# Altium schematic sheet BMS (1).SchDoc
size OrCAD C; SheetNumber: 1; SheetTotal: 1
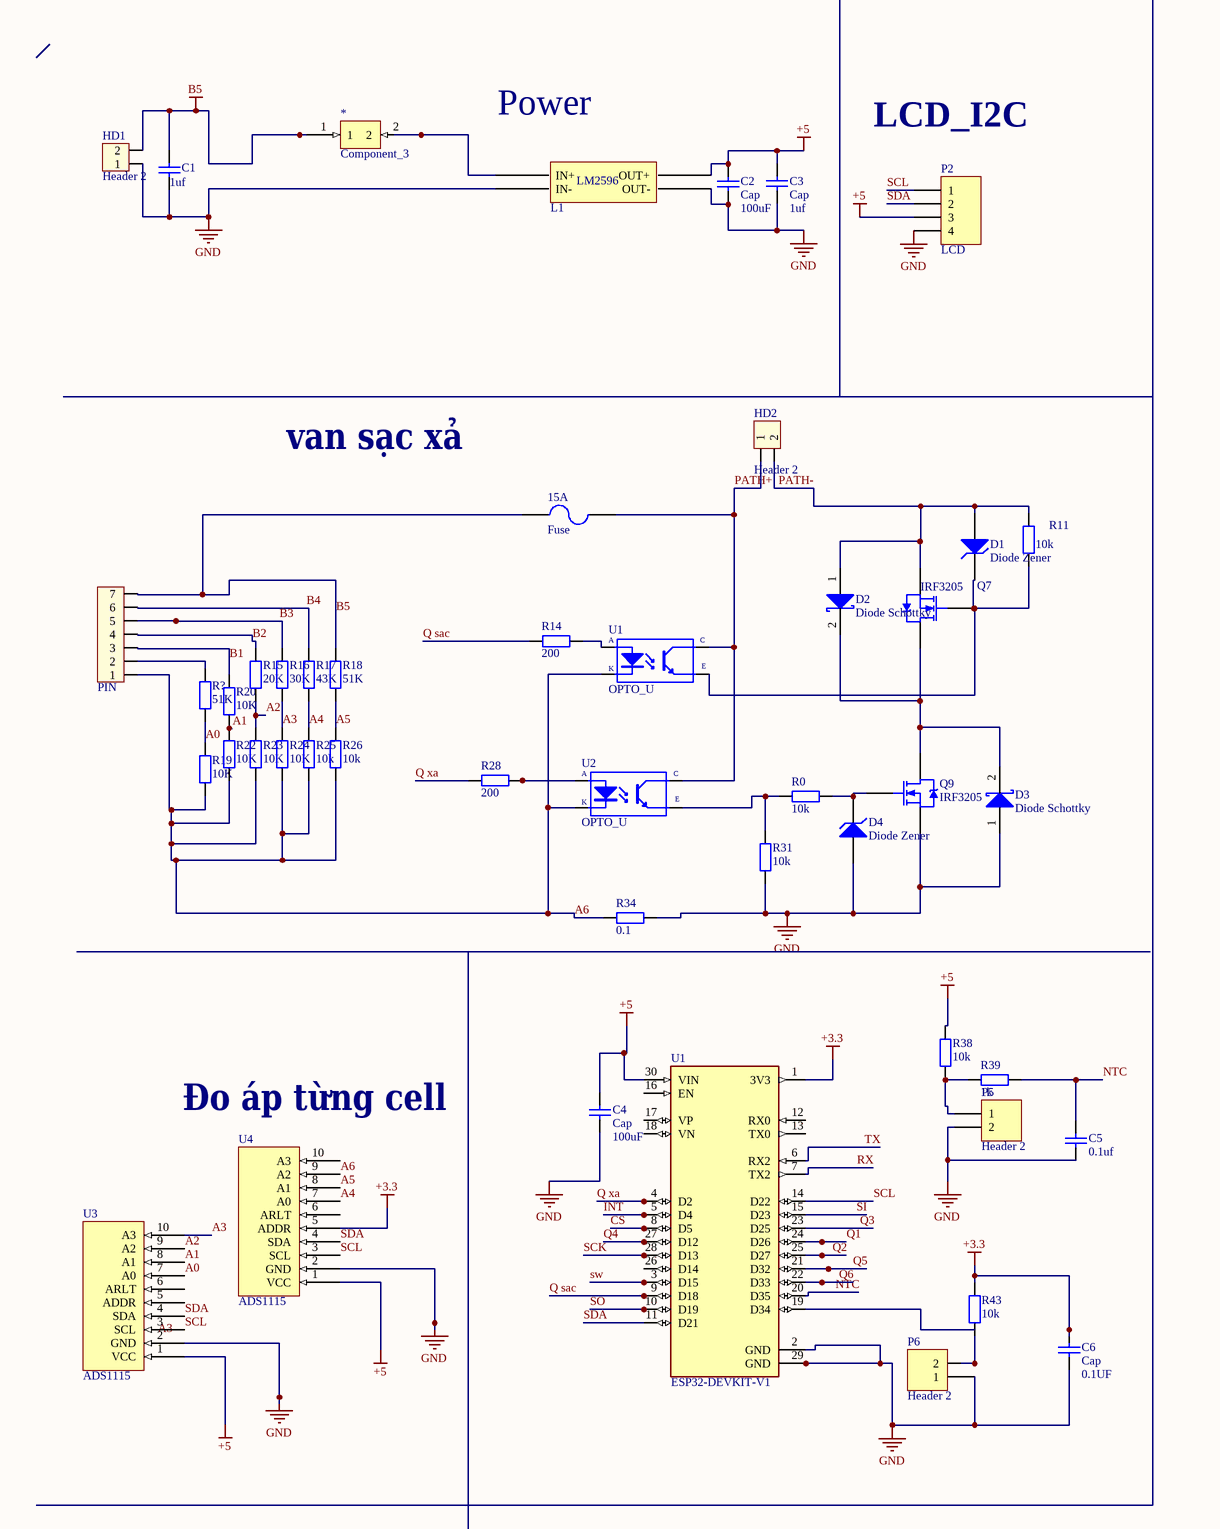
[diagram p0: BMS (1).SchDoc, left]
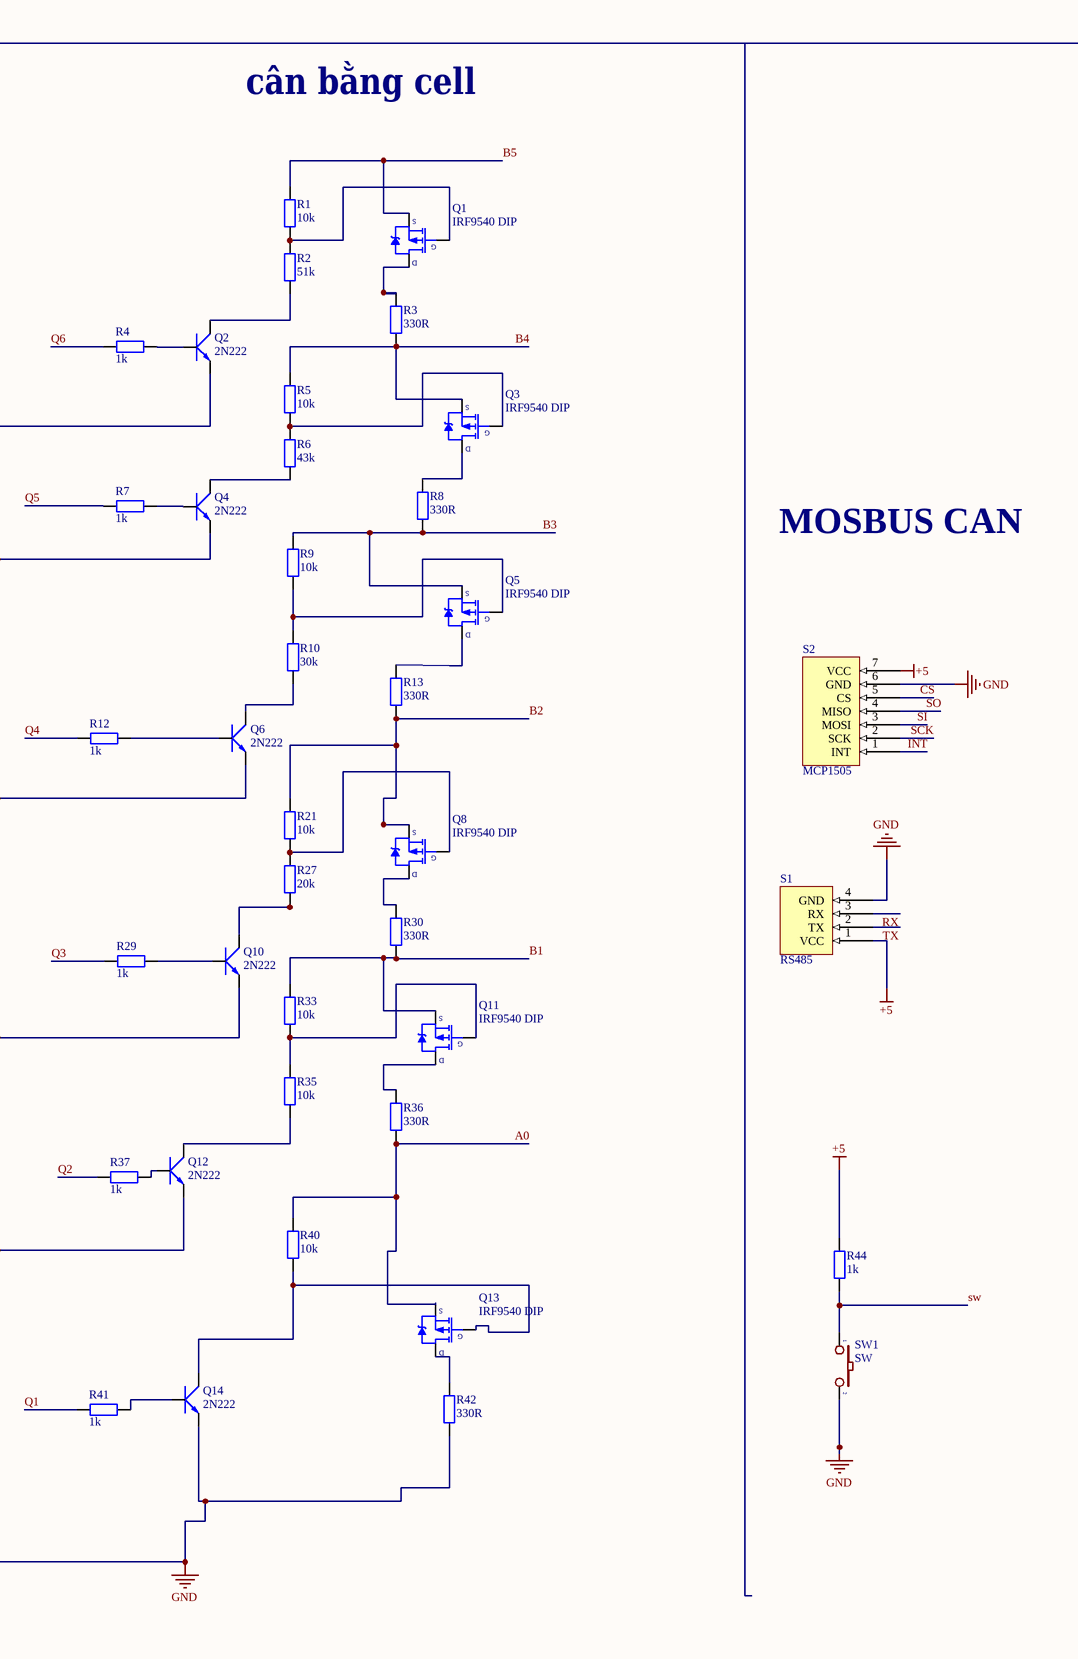
[diagram p1: BMS (1).SchDoc, right]

## Parts
(Parts that share a designator on the sheet are numbered #1, #2 ... from top to bottom, then left to right.)
15A  Fuse  [Fuse]
*  Component_3  [PCBComponent_1]
C1  value 1uf  [C3MM]  (hidden comment: Cap)
C2  Cap  value 100uF  [C3MM]
C3  Cap  value 1uf  [C3MM]
C4  Cap  value 100uF  [C3MM]
C5  0.1uf  [C3MM]
C6  Cap  value 0.1UF  [C3MM]
D1  Diode Zener  [DIODE/NOM/0.5A]
D2  Diode Schottky  [DO-35]
D3  Diode Schottky  [DO-35]
D4  Diode Zener  [DIODE/NOM/0.5A]
H?  PIN  [Header 7P DC 2.54]
HD1  Header 2  [HED2]
HD2  Header 2  [HED2]
L1  (no value)  [BUCK_LM2596]
P2  LCD  [HDR1X4]
P5  Header 2  [Header 2]
P6  Header 2  [Header 2]
Q1  IRF9540 DIP  [TO220]
Q2  2N222  [TO92-123]
Q3  IRF9540 DIP  [TO220]
Q4  2N222  [TO92-123]
Q5  IRF9540 DIP  [TO220]
Q6  2N222  [TO92-123]
Q7  IRF3205  [TO220]
Q8  IRF9540 DIP  [TO220]
Q9  IRF3205  [TO220]
Q10  2N222  [TO92-123]
Q11  IRF9540 DIP  [TO220]
Q12  2N222  [TO92-123]
Q13  IRF9540 DIP  [TO220]
Q14  2N222  [TO92-123]
R0  10k  [tro vach 1/2w]
R1  10k  [tro vach 1/2w]
R2  51k  [tro vach 1/2w]
R3  330R  [tro vach 2w]
R4  1k  [tro vach 1/4w]
R5  10k  [tro vach 1/2w]
R6  43k  [tro vach 1/2w]
R7  1k  [tro vach 1/4w]
R8  330R  [tro vach 2w]
R9  10k  [tro vach 1/2w]
R10  30k  [tro vach 1/2w]
R11  10k  [tro vach 1/2w]
R12  1k  [tro vach 1/4w]
R13  330R  [tro vach 2w]
R14  200  [tro vach 1/2w]
R15  20K  [tro vach 1/2w]
R16  30K  [tro vach 1/2w]
R17  43K  [tro vach 1/2w]
R18  51K  [tro vach 1/2w]
R19  10K  [tro vach 1/2w]
R20  10K  [tro vach 1/2w]
R21  10k  [tro vach 1/2w]
R22  10K  [tro vach 1/2w]
R23  10K  [tro vach 1/2w]
R24  10K  [tro vach 1/2w]
R25  10k  [tro vach 1/2w]
R26  10k  [tro vach 1/2w]
R27  20k  [tro vach 1/2w]
R28  200  [tro vach 1/2w]
R29  1k  [tro vach 1/4w]
R30  330R  [tro vach 2w]
R31  10k  [tro vach 1/2w]
R33  10k  [tro vach 1/2w]
R34  0.1  [tro vach 3w]
R35  10k  [tro vach 1/2w]
R36  330R  [tro vach 2w]
R37  1k  [tro vach 1/4w]
R38  10k  [tro vach 1/2w]
R39  1k  [tro vach 1/2w]
R40  10k  [tro vach 1/2w]
R41  1k  [tro vach 1/4w]
R42  330R  [tro vach 2w]
R43  10k  [tro vach 1/2w]
R44  1k  [tro vach 1/4w]
R?  51K  [tro vach 1/2w]
S1  RS485  [PCBComponent_1]
S2  MCP1505  [PCBComponent_1]
SW1  SW  [SW2]
U1#1  OPTO_U  [OPTO_U]
U1#2  ESP32-DEVKIT-V1  [MODULE_ESP32_DEVKIT_V1]
U2  OPTO_U  [OPTO_U]
U3  ADS1115  [ADS1115]
U4  ADS1115  [ADS1115]

## Nets
+3.3: C6.2 R43.1 U1#2.1(3V3) U4.5(ADDR)
+5: C2.2 C3.2 C4.2 L1.4(OUT+) P2.3 R38.1 R44.1 S1.1(VCC) S2.7(VCC) U1#2.30(VIN) U3.1(VCC) U4.1(VCC)
B5: 15A.1 *.1 C1.2 H?.7 HD1.2 Q1.3(S) R1.2 R18.2
GND: C1.1 C2.1 C3.1 C4.1 C5.1 C6.1 D3.1(A) D4.1(A) HD1.1 L1.2(IN-) L1.3(OUT-) P2.4 P5.2 P6.1 Q2.1(E) Q4.1(E) Q6.1(E) Q9.3(S) Q10.1(E) Q12.1(E) Q14.1(E) R31.2 R34.2 R42.1 S1.4(GND) S2.6(GND) SW1.2 U1#2.2(GND) U1#2.29(GND) U3.2(GND) U4.2(GND)
A0: Q13.3(S) R19.2 R36.1 R40.2 R?.1 U3.7(A0)
A1: R20.1 R22.2 U3.8(A1)
A2: R15.1 R23.2 U3.9(A2)
A3: R16.1 R24.2 U3.10(A3)
A4: R17.1 R25.2 U4.7(A0)
A5: R18.1 R26.2 U4.8(A1)
A6: H?.1 R19.1 R22.1 R23.1 R24.1 R25.1 R26.1 R34.1 U1#1.K U2.K U4.9(A2)
B1: H?.3 Q11.3(S) R20.2 R30.1 R33.2
B2: H?.4 Q8.3(S) R13.1 R15.2 R21.2
B3: H?.5 Q5.3(S) R8.1 R9.2 R16.2
B4: H?.6 Q3.3(S) R3.1 R5.2 R17.2
CS: S2.5(CS) U1#2.8(D5)
INT: S2.1(INT) U1#2.5(D4)
NTC: C5.2 R39.2 U1#2.20(D35)
PATH+: 15A.2 HD2.1 U1#1.C U2.C
PATH-: D1.1(A) D2.1(A) HD2.2 Q7.3(S) R11.2
Q1: R41.2 U1#2.24(D26)
Q2: R37.2 U1#2.25(D27)
Q3: R29.2 U1#2.23(D25)
Q4: R12.2 U1#2.27(D12)
Q5: R7.2 U1#2.21(D32)
Q6: R4.2 U1#2.22(D33)
Q sac: R14.2 U1#2.9(D18)
Q xa: R28.2 U1#2.4(D2)
RX: S1.3(RX) U1#2.7(TX2)
SCK: S2.2(SCK) U1#2.28(D13)
SCL: P2.1 U1#2.14(D22) U3.3(SCL) U4.3(SCL)
SDA: P2.2 U1#2.11(D21) U3.4(SDA) U4.4(SDA)
SI: S2.3(MOSI) U1#2.15(D23)
SO: S2.4(MISO) U1#2.10(D19)
sw: R44.2 SW1.1 U1#2.3(D15)
TX: S1.2(TX) U1#2.6(RX2)
Net*_2: *.2 L1.1(IN+)
NetD1_2: D1.2(K) Q7.1(G) R11.1 U1#1.E
NetD2_2: D2.2 D3.2 Q7.2(D) Q9.2(D)
NetD4_2: D4.2(K) Q9.1(G) R0.2
NetH?_2: H?.2 R?.2
NetP5_1: P5.1 R38.2 R39.1
NetP6_2: P6.2 R43.2
NetQ1_1: Q1.1(G) R1.1 R2.2
NetQ1_2: Q1.2(D) R3.2
NetQ2_2: Q2.2(B) R4.1
NetQ2_3: Q2.3(C) R2.1
NetQ3_1: Q3.1(G) R5.1 R6.2
NetQ3_2: Q3.2(D) R8.2
NetQ4_2: Q4.2(B) R7.1
NetQ4_3: Q4.3(C) R6.1
NetQ5_1: Q5.1(G) R9.1 R10.2
NetQ5_2: Q5.2(D) R13.2
NetQ6_2: Q6.2(B) R12.1
NetQ6_3: Q6.3(C) R10.1
NetQ8_1: Q8.1(G) R21.1 R27.2
NetQ8_2: Q8.2(D) R30.2
NetQ10_2: Q10.2(B) R29.1
NetQ10_3: Q10.3(C) R27.1
NetQ11_1: Q11.1(G) R33.1 R35.2
NetQ11_2: Q11.2(D) R36.2
NetQ12_2: Q12.2(B) R37.1
NetQ12_3: Q12.3(C) R35.1
NetQ13_1: Q13.1(G) Q14.3(C) R40.1
NetQ13_2: Q13.2(D) R42.2
NetQ14_2: Q14.2(B) R41.1
NetR0_1: R0.1 R31.1 U2.E
NetR14_1: R14.1 U1#1.A
NetR28_1: R28.1 U2.A

Not connected (* = marked no-connect by the designer): U1#2 12(RX0) 13(TX0) 16(EN) 17(VP) 18(VN) 19(D34) 26(D14); U3 5(ADDR) 6(ARLT); U4 6(ARLT) 10(A3)

## Notes on the sheet
- cân bằng cell
- (near L1) Power
- LCD_I2C
- van sạc xả
- MOSBUS CAN
- (near U4) Đo áp từng cell
- Labels drawn without touching a wire or pin: A3
- (in symbol BUCK_LM2596) LM2596

## Library data of the parts
C1-C6 = Cap: Capacitor; Published: 8-Jun-2000; LatestRevisionDate: 17-Jul-2002; LatestRevisionNote: Re-released for DXP Platform.; PackageReference: RAD-0.3; Publisher: Altium Limited
D1 D4 = Diode Zener_1: Zener Diode; Published: 8-Jun-2000; LatestRevisionDate: 17-Jul-2002; LatestRevisionNote: Re-released for DXP Platform.; PackageReference: DIODE-0.7; Publisher: Altium Limited
D2 D3 = Diode Schottky: Schottky Rectifier; Note: Terminal 2 is the TAB and is electrically connected to the cathode; Published: 8-Jun-2000; LatestRevisionDate: 17-Jul-2002; LatestRevisionNote: Re-released for DXP Platform.; DatasheetDocument: PD-2.057B; PackageDocument: Feb-1998; PackageReference: TO-220AC; Publisher: Altium Limited; ComponentLink1Description: Manufacturer Link; ComponentLink1URL: http://www.irf.com/; ComponentLink2Description: Datasheet; ComponentLink2URL: http://www.irf.com/product-info/datasheets/data/10tq.pdf
H? = Header 7P 2.54 Duc Cong: Cắm; Ten_Linh_Kien: Header 7P XH2.54-7P Đực Cong; Don_Vi: Con; Ma_Hang: MH004118; Chung_Loai: Cắm
HD1 HD2 = Hed2: Header 2 (Green); Value: Header 2
L1 = BUCK_LM2596
P2 = Header 4x1: Header, 4 Pin Pitch 2.54mm; MPN: S1012EC-40-ND; CompanyID: VT-00125; Solder: WAVE; Value: Header 4P
P5 P6 = Header 2: Header, 2-Pin; LatestRevisionDate: 17-Jul-2002; LatestRevisionNote: Re-released for DXP Platform.; Publisher: Altium Limited
Q1 Q3 Q5 Q8 Q11 Q13 = FET IRF9540 DIP: TO-200; Note: Pin 2 is electrically connected to pin 4.; Published: 8-Jun-2000; LatestRevisionDate: 17-Jul-2002; LatestRevisionNote: Re-released for DXP Platform.; DatasheetVersion: PD-9.421C; PackageVersion: Feb-1997; PackageReference: TO-220AB; Publisher: Altium Limited; PackageDescription: TO, Thru-Hole, Vertical, Heatsink Mounted; 3 In-Line Leads; Pitch 2.54 mm; ComponentLink1Description: Manufacturer Link; ComponentLink1URL: http://www.irf.com/; ComponentLink2Description: Datasheet; ComponentLink2URL: http://www.irf.com/product-info/datasheets/data/irf9540.pdf
Q2 Q4 Q6 Q10 Q12 Q14 = 2N222: NPN 600mW, ECB; Value: C1815
Q7 Q9 = FET IRF3709 DIP: TO-200
R0-R2 R5 R6 R9-R11 R14-R28 R31 R33 R35 R38-R40 R43 R? = Tro Vach 1/2W 5% 1k: Cắm; Don_Vi: Con; So_Chan: 2; Ten_Linh_Kien: Trở 5% 1/2w 1K; Ma_Hang: MH007240; Chung_Loai: Cắm; Kieu_Chan: *
R3 R8 R13 R30 R36 R42 = Tro Vach 2W 5% 330R: Cắm; Ma_Hang: MH006373; Don_Vi: Con; So_Chan: 2; Ten_Linh_Kien: Trở 5% 2w 330R; Chung_Loai: Cắm; Kieu_Chan: *
R4 R7 R12 R29 R37 R41 R44 = Tro Vach 1/4W 5% 1R: Cắm; Don_Vi: Con; So_Chan: 2; Ten_Linh_Kien: Trở Vạch 1/4w 5% 1R; Ma_Hang: MH007394; Chung_Loai: Cắm; Kieu_Chan: *
R34 = Tro Vach 3W 5% 0.02R: Cắm; Don_Vi: Con; So_Chan: 2; Ten_Linh_Kien: Trở 5% 3w 0.02R; Ma_Hang: MH007953; Chung_Loai: Cắm; Kieu_Chan: *
S1 = Component_3
S2 = Component_5: pin to pad: 1>7 2>6 3>5 5>3 6>2 7>1
SW1 = SW2: Switch button 2 pin; Value: SW chip 2 pin
U1#1 U2 = OPTO_U: Single Opto; Value: TLP5211
U1#2 = ESP32-DEVKIT-V1: Dual core, Wi-Fi: 2.4 GHz up to 150 Mbits/s,BLE (Bluetooth Low Energy) and legacy Bluetooth, 32 bits, Up to 240 MHz; Value: *; MP: ESP32-DEVKIT-V1; Availability: Unavailable; Package: None; Price: None
U3 U4 = Component_2
15A = Fuse: Published: 8-Jun-2000; LatestRevisionDate: 17-Jul-2002; LatestRevisionNote: Re-released for DXP Platform.; PackageReference: PIN-W2/E2.8; Publisher: Altium Limited